# Altium schematic sheet Relay-Switch.SchDoc (part 2 of 2)
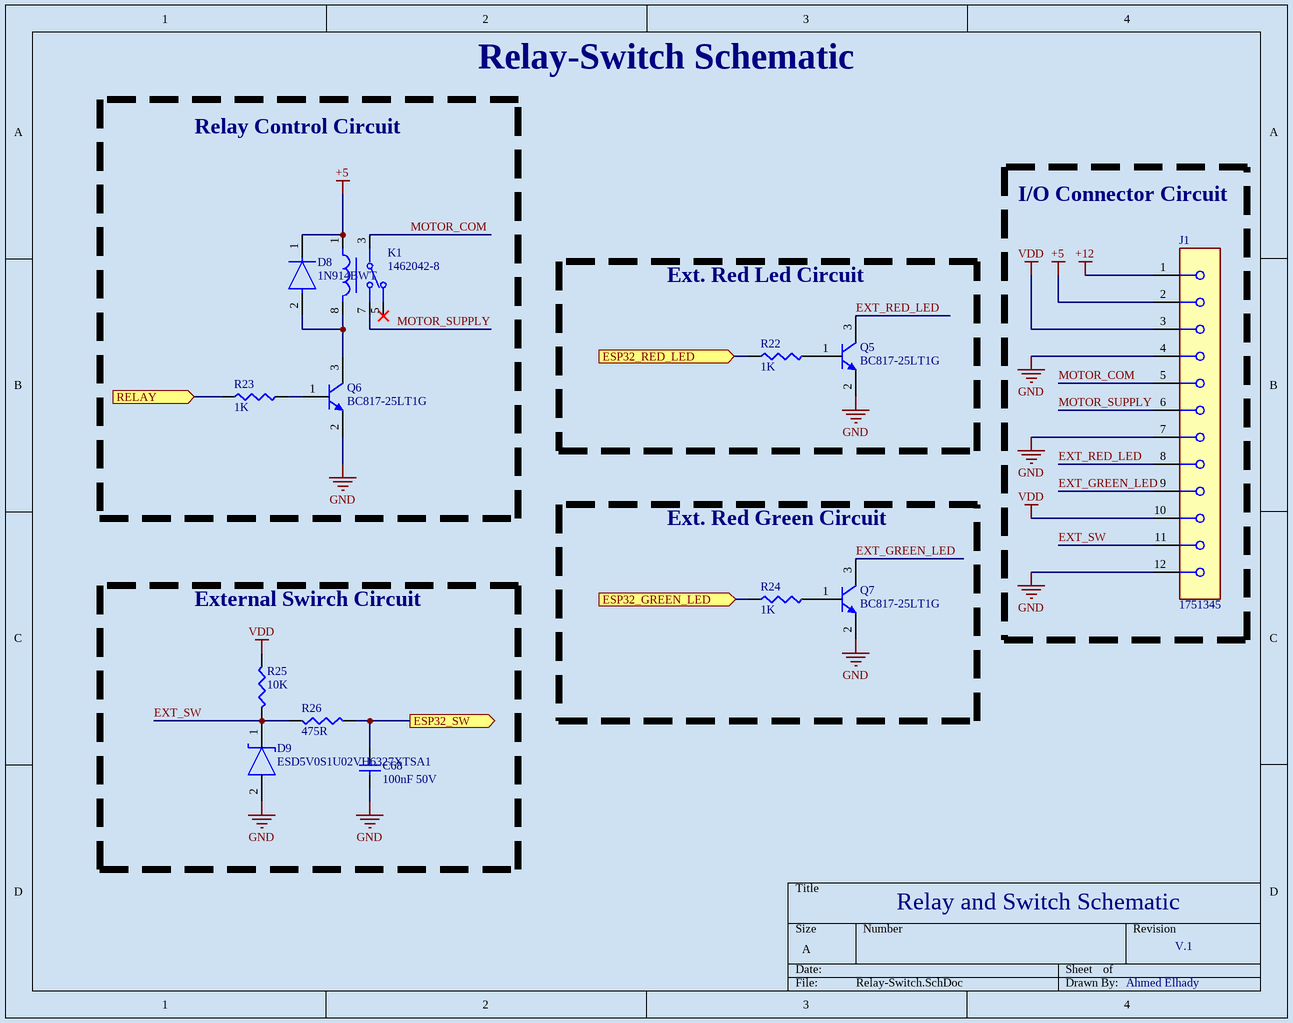
[diagram p1: Relay-Switch.SchDoc]

## Library data of the parts
C68 = CGA3E2X7R1H104K080AA: 0.1 µF ±10% 50V Ceramic Capacitor X7R 0603 (1608 Metric); Manufacturer: TDK; Manufacturer Lifecycle Status: PRODUCTION; Supplier: DigiKey; Manufacturer Part Number: CGA3E2X7R1H104K080AA; RoHS: Compliant; Category: Ceramic Capacitors; Stock: 973492; Pricing: 1=0.1, 10=0.044, 50=0.0302, 100=0.026, 500=0.01886, 1000=0.01666 (USD); Value: 100nF; Case/Package: 0603; Case Code (Imperial): 0603; Case Code (Metric): 1608; China RoHS: Compliant; Composition: Ceramic; Depth: 800µm; Dielectric: X7R; Dielectric Material: Ceramic; Height: 800µm; Lead Free: Lead Free; Length: 1.6mm; Lifecycle Status: Production; Material: Ceramic; Max Length: 1.7mm; Max Operating Temperature: 125°C; Max Width: 900µm; Min Length: 1.5mm; Min Operating Temperature: -55°C; Min Width: 700µm; Mounting Technology: Surface Mount; Number of Terminals: 2; Radiation Hardening: No; Ratings: AEC-Q200; REACH SVHC: Yes; Schedule B: 8532240020, 8532240020|8532240020|8532240020|8532240020|8532240020; Termination: SMD/SMT; Thickness: 889µm; Tolerance: 10%; Voltage: 50V; Voltage Rating: 50V; Voltage Rating (DC): 50V; Weight: 2.012816mg; Width: 800µm; ComponentLink1URL: https://datasheet.octopart.com:443/CGA3E2X7R1H104K080AA-TDK-datasheet-165583812.pdf?src-supplier=IHS; ComponentLink1Description: https://datasheet.octopart.com:443/CGA3E2X7R1H104K080AA-TDK-datasheet-165583812.pdf?src-supplier=IHS; ComponentLink2URL: https://datasheet.octopart.com:443/CGA3E2X7R1H104K080AA-TDK-datasheet-138890726.pdf?src-supplier=Upverter; ComponentLink2Description: https://datasheet.octopart.com:443/CGA3E2X7R1H104K080AA-TDK-datasheet-138890726.pdf?src-supplier=Upverter; ComponentLink3URL: https://datasheet.octopart.com:443/CGA3E2X7R1H104K080AA-TDK-datasheet-43457115.pdf?src-supplier=Upverter; ComponentLink3Description: https://datasheet.octopart.com:443/CGA3E2X7R1H104K080AA-TDK-datasheet-43457115.pdf?src-supplier=Upverter; ComponentLink4URL: https://datasheet.octopart.com:443/CGA3E2X7R1H104K080AA-TDK-datasheet-151546526.pdf?src-supplier=ODG+(Origin+Data+Global); ComponentLink4Description: https://datasheet.octopart.com:443/CGA3E2X7R1H104K080AA-TDK-datasheet-151546526.pdf?src-supplier=ODG+(Origin+Data+Global); ComponentLink5URL: https://datasheet.octopart.com:443/CGA3E2X7R1H104K080AA-TDK-datasheet-43366117.pdf?src-supplier=Newark; ComponentLink5Description: https://datasheet.octopart.com:443/CGA3E2X7R1H104K080AA-TDK-datasheet-43366117.pdf?src-supplier=Newark; ComponentLink6URL: https://datasheet.octopart.com:443/CGA3E2X7R1H104K080AA-TDK-datasheet-23766614.pdf?src-supplier=Newark; ComponentLink6Description: https://datasheet.octopart.com:443/CGA3E2X7R1H104K080AA-TDK-datasheet-23766614.pdf?src-supplier=Newark; ComponentLink7URL: https://datasheet.octopart.com:443/CGA3E2X7R1H104K080AA-TDK-datasheet-13444418.pdf?src-supplier=Newark; ComponentLink7Description: https://datasheet.octopart.com:443/CGA3E2X7R1H104K080AA-TDK-datasheet-13444418.pdf?src-supplier=Newark; ComponentLink8URL: https://datasheet.octopart.com:443/CGA3E2X7R1H104K080AA.-TDK-datasheet-159510193.pdf?src-supplier=Newark; ComponentLink8Description: https://datasheet.octopart.com:443/CGA3E2X7R1H104K080AA.-TDK-datasheet-159510193.pdf?src-supplier=Newark; ComponentLink9URL: https://datasheet.octopart.com:443/CGA3E2X7R1H104K080AA-TDK-datasheet-136412745.pdf?src-supplier=element14+APAC; ComponentLink9Description: https://datasheet.octopart.com:443/CGA3E2X7R1H104K080AA-TDK-datasheet-136412745.pdf?src-supplier=element14+APAC; ComponentLink10URL: https://datasheet.octopart.com:443/CGA3E2X7R1H104K080AA-TDK-datasheet-21217900.pdf?src-supplier=Farnell; ComponentLink10Description: https://datasheet.octopart.com:443/CGA3E2X7R1H104K080AA-TDK-datasheet-21217900.pdf?src-supplier=Farnell; ComponentLink11URL: https://datasheet.octopart.com:443/CGA3E2X7R1H104K080AA-TDK-datasheet-164882302.pdf?src-supplier=Burklin+Elektronik; ComponentLink11Description: https://datasheet.octopart.com:443/CGA3E2X7R1H104K080AA-TDK-datasheet-164882302.pdf?src-supplier=Burklin+Elektronik; ComponentLink12URL: https://datasheet.octopart.com:443/CGA3E2X7R1H104K080AA-TDK-datasheet-13234200.pdf?src-supplier=Future+Electronics; ComponentLink12Description: https://datasheet.octopart.com:443/CGA3E2X7R1H104K080AA-TDK-datasheet-13234200.pdf?src-supplier=Future+Electronics; ComponentLink13URL: https://datasheet.octopart.com:443/CGA3E2X7R1H104K080AA-TDK-datasheet-12527010.pdf?src-supplier=Future+Electronics; ComponentLink13Description: https://datasheet.octopart.com:443/CGA3E2X7R1H104K080AA-TDK-datasheet-12527010.pdf?src-supplier=Future+Electronics; ComponentLink14URL: https://datasheet.octopart.com:443/CGA3E2X7R1H104K080AA-TDK-datasheet-140571036.pdf?src-supplier=Arrow.cn; ComponentLink14Description: https://datasheet.octopart.com:443/CGA3E2X7R1H104K080AA-TDK-datasheet-140571036.pdf?src-supplier=Arrow.cn; LCSC PN: C189228
D8 = 1N914BWT: Diode 75 V 200mA Surface Mount SOD-523F; Manufacturer: onsemi; Manufacturer Lifecycle Status: ACTIVE; Value: 4pF; Element Configuration: Single; Forward Current: 300mA; Forward Voltage: 720mV; Max Junction Temperature (Tj): 150°C; Max Output current: 150mA; Max Power Dissipation: 200mW; Max Repetitive Reverse Voltage (Vrrm): 75V; Max Reverse Leakage Current: 5µA; Number of Elements: 1; Recovery Time: 4ns; Reverse Voltage: 100V; Supplier: DigiKey; Manufacturer Part Number: 1N914BWT; RoHS: Compliant; Category: Rectifier Diodes; Stock: 477421; Pricing: 1=0.1, 10=0.049, 100=0.0485, 500=0.038, 1000=0.03306, 2000=0.03258 (USD); Average Rectified Current: 200mA; China RoHS: Compliant; Contact Plating: Tin; Height: 700µm; Lead Free: Lead Free; Lifecycle Status: Production; Max Operating Temperature: 150°C; Max Reverse Voltage (DC): 75V; Min Operating Temperature: -55°C; Mounting Technology: Surface Mount; Pins: 2; Number of Terminals: 2; Peak Reverse Current: 5µA; Power Dissipation: 200mW; Radiation Hardening: No; REACH SVHC: Yes; Reverse Recovery Time: 4ns; Reverse Standoff Voltage: 75V; Schedule B: 8541100070, 8541100070|8541100070|8541100070|8541100070|8541100070; Weight: 10mg; ComponentLink1URL: https://datasheet.octopart.com:443/1N914BWT-ON-Semiconductor-datasheet-137236191.pdf?src-supplier=Master+Electronics; ComponentLink1Description: https://datasheet.octopart.com:443/1N914BWT-ON-Semiconductor-datasheet-137236191.pdf?src-supplier=Master+Electronics; ComponentLink2URL: https://sigma.octopart.com:443/138897313/technical_drawing/ON-Semiconductor-1N914BWT.pdf?src-supplier=Upverter; ComponentLink2Description: https://sigma.octopart.com:443/138897313/technical_drawing/ON-Semiconductor-1N914BWT.pdf?src-supplier=Upverter; ComponentLink3URL: https://datasheet.octopart.com:443/1N914BWT-ON-Semiconductor-datasheet-8641207.pdf?src-supplier=IHS; ComponentLink3Description: https://datasheet.octopart.com:443/1N914BWT-ON-Semiconductor-datasheet-8641207.pdf?src-supplier=IHS; ComponentLink4URL: https://datasheet.octopart.com:443/1N914BWT-onsemi-datasheet-181265884.pdf?src-supplier=IHS; ComponentLink4Description: https://datasheet.octopart.com:443/1N914BWT-onsemi-datasheet-181265884.pdf?src-supplier=IHS; ComponentLink5URL: https://datasheet.octopart.com:443/1N914BWT-ON-Semiconductor-datasheet-85393215.pdf?src-supplier=onsemi; ComponentLink5Description: https://datasheet.octopart.com:443/1N914BWT-ON-Semiconductor-datasheet-85393215.pdf?src-supplier=onsemi; ComponentLink6URL: https://datasheet.octopart.com:443/1N914BWT-ON-Semiconductor-datasheet-86684494.pdf?src-supplier=onsemi; ComponentLink6Description: https://datasheet.octopart.com:443/1N914BWT-ON-Semiconductor-datasheet-86684494.pdf?src-supplier=onsemi; ComponentLink7URL: https://datasheet.octopart.com:443/1N914BWT-ON-Semiconductor-datasheet-86681974.pdf?src-supplier=element14+APAC; ComponentLink7Description: https://datasheet.octopart.com:443/1N914BWT-ON-Semiconductor-datasheet-86681974.pdf?src-supplier=element14+APAC; ComponentLink8URL: https://datasheet.octopart.com:443/1N914BWT-Fairchild-datasheet-597795.pdf?src-supplier=Future+Electronics; ComponentLink8Description: https://datasheet.octopart.com:443/1N914BWT-Fairchild-datasheet-597795.pdf?src-supplier=Future+Electronics; ComponentLink9URL: https://sigma.octopart.com:443/17343427/technical_drawing/Fairchild-Semiconductor-1N914BWT.pdf?src-supplier=Fairchild+Semiconductor; ComponentLink9Description: https://sigma.octopart.com:443/17343427/technical_drawing/Fairchild-Semiconductor-1N914BWT.pdf?src-supplier=Fairchild+Semiconductor; ComponentLink10URL: https://datasheet.octopart.com:443/1N914BWT-Fairchild-Semiconductor-datasheet-67878665.pdf?src-supplier=Farnell; ComponentLink10Description: https://datasheet.octopart.com:443/1N914BWT-Fairchild-Semiconductor-datasheet-67878665.pdf?src-supplier=Farnell; ComponentLink11URL: https://datasheet.octopart.com:443/1N914BWT-Fairchild-Semiconductor-datasheet-68649996.pdf?src-supplier=Farnell; ComponentLink11Description: https://datasheet.octopart.com:443/1N914BWT-Fairchild-Semiconductor-datasheet-68649996.pdf?src-supplier=Farnell; ComponentLink12URL: https://datasheet.octopart.com:443/1N914BWT-Fairchild-Semiconductor-datasheet-78857206.pdf?src-supplier=Farnell; ComponentLink12Description: https://datasheet.octopart.com:443/1N914BWT-Fairchild-Semiconductor-datasheet-78857206.pdf?src-supplier=Farnell; ComponentLink13URL: https://datasheet.octopart.com:443/1N914BWT-Fairchild-Semiconductor-datasheet-67909706.pdf?src-supplier=Newark; ComponentLink13Description: https://datasheet.octopart.com:443/1N914BWT-Fairchild-Semiconductor-datasheet-67909706.pdf?src-supplier=Newark; ComponentLink14URL: https://datasheet.octopart.com:443/1N914BWT-Fairchild-Semiconductor-datasheet-68364971.pdf?src-supplier=Newark; ComponentLink14Description: https://datasheet.octopart.com:443/1N914BWT-Fairchild-Semiconductor-datasheet-68364971.pdf?src-supplier=Newark; ComponentLink15URL: https://datasheet.octopart.com:443/1N914BWT-Fairchild-Semiconductor-datasheet-71421042.pdf?src-supplier=Newark; ComponentLink15Description: https://datasheet.octopart.com:443/1N914BWT-Fairchild-Semiconductor-datasheet-71421042.pdf?src-supplier=Newark; ComponentLink16URL: http://sigma.octopart.com:80/150599636/rohs_statement/ON-Semiconductor-1N914BWT.pdf?src-supplier=Compliance+Statements; ComponentLink16Description: http://sigma.octopart.com:80/150599636/rohs_statement/ON-Semiconductor-1N914BWT.pdf?src-supplier=Compliance+Statements; ComponentLink17URL: http://sigma.octopart.com:80/17343722/reach_statement/Fairchild-Semiconductor-1N914BWT.pdf?src-supplier=Compliance+Statements; ComponentLink17Description: http://sigma.octopart.com:80/17343722/reach_statement/Fairchild-Semiconductor-1N914BWT.pdf?src-supplier=Compliance+Statements; ComponentLink18URL: http://sigma.octopart.com:80/17343723/materials_sheet/Fairchild-Semiconductor-1N914BWT.pdf?src-supplier=Compliance+Statements; ComponentLink18Description: http://sigma.octopart.com:80/17343723/materials_sheet/Fairchild-Semiconductor-1N914BWT.pdf?src-supplier=Compliance+Statements; ComponentLink19URL: http://sigma.octopart.com:80/33033631/reach_statement/Fairchild-Semiconductor-1N914BWT.pdf?src-supplier=Compliance+Statements; ComponentLink19Description: http://sigma.octopart.com:80/33033631/reach_statement/Fairchild-Semiconductor-1N914BWT.pdf?src-supplier=Compliance+Statements; ComponentLink20URL: http://sigma.octopart.com:80/33033633/materials_sheet/Fairchild-Semiconductor-1N914BWT.pdf?src-supplier=Compliance+Statements; ComponentLink20Description: http://sigma.octopart.com:80/33033633/materials_sheet/Fairchild-Semiconductor-1N914BWT.pdf?src-supplier=Compliance+Statements; ComponentLink21URL: http://sigma.octopart.com:80/reach_statement/ON-Semiconductor-company-79.pdf?src-supplier=Compliance+Statements; ComponentLink21Description: http://sigma.octopart.com:80/reach_statement/ON-Semiconductor-company-79.pdf?src-supplier=Compliance+Statements; ComponentLink22URL: http://sigma.octopart.com:80/reach_statement/Fairchild-Semiconductor-company-9.pdf?src-supplier=Compliance+Statements; ComponentLink22Description: http://sigma.octopart.com:80/reach_statement/Fairchild-Semiconductor-company-9.pdf?src-supplier=Compliance+Statements; ComponentLink23URL: http://sigma.octopart.com:80/rohs_statement/Fairchild-Semiconductor-company-10.pdf?src-supplier=Compliance+Statements; ComponentLink23Description: http://sigma.octopart.com:80/rohs_statement/Fairchild-Semiconductor-company-10.pdf?src-supplier=Compliance+Statements; ComponentLink24URL: http://sigma.octopart.com:80/rohs_statement/Fairchild-Semiconductor-company-11.pdf?src-supplier=Compliance+Statements; ComponentLink24Description: http://sigma.octopart.com:80/rohs_statement/Fairchild-Semiconductor-company-11.pdf?src-supplier=Compliance+Statements; ComponentLink25URL: https://octopart.com:443/opatz8j6/c1?t=2WqiEKOw8wqArRZqPpvR85ynHt7ZzVk2cO10dLGm-R0uzi761TwnKGd8G704mGlWt5NrywDr0KiccpzbdVN0vLD60p8HUNozkBvJah_YtAF0qkz_YdCTpuTRvpRRGRHvTs5MnoSWnaWLNMk8GsWHB5GOWZxEGL76QI-UHf2VYZrxGgdInPPAHzx67g23p6ag1zMjOvdQ_KO0sLW1YCbP87miLJ-xuglZHSzMiJPSla-JOyFE5O4L_wVOcXuUuW9Nq80bDDjFIEvXv_yLg6OaI31d8ivh4qXBzQAE5bOv_0EkyUSKc6N_Bvj2gIrePwDtp1ZIMUr8bvv7xrz_Ey9Bd0_sQCggic841Ck&src-supplier=Compliance+Statements; ComponentLink25Description: https://octopart.com:443/opatz8j6/c1?t=2WqiEKOw8wqArRZqPpvR85ynHt7ZzVk2cO10dLGm-R0uzi761TwnKGd8G704mGlWt5NrywDr0KiccpzbdVN0vLD60p8HUNozkBvJah_YtAF0qkz_YdCTpuTRvpRRGRHvTs5MnoSWnaWLNMk8GsWHB5GOWZxEGL76QI-UHf2VYZrxGgdInPPAHzx67g23p6ag1zMjOvdQ_KO0sLW1YCbP87miLJ-xuglZHSzMiJPSla-JOyFE5O4L_wVOcXuUuW9Nq80bDDjFIEvXv_yLg6OaI31d8ivh4qXBzQAE5bOv_0EkyUSKc6N_Bvj2gIrePwDtp1ZIMUr8bvv7xrz_Ey9Bd0_sQCggic841Ck&src-supplier=Compliance+Statements; ComponentLink26URL: https://octopart.com:443/opatz8j6/c1?t=RaqNgoITNyWOJnQ6Vh5XIuzQpAbr0CmMJXnszeBW8MsXPXzYAlD6RDR-K-xNy0bOoPbUZIWRPJiazHjtXn9auSuHtYVzaYiY_-4ACrRiEunSg5ftXbk51fnzLHl-pnx-xENRGEoc0sVQC3sW6At9uQOqTuvKnbOKqBSmNHH-_AM452Vbz-1SYlG8b9doSGgNLF68ZLSsI2Xi9YbSWNoCRNsA0utVy25_kYVX52Ab7j5ee_hVQPYkWwgdnH6jdHziL8hQDhpeIfaPz7mxVfqPvCOhRP-Nv0lQS1TZTbPLcILF8nRMY4HoGGGhnPru0GeEwc_xKGUtBaA48gLnW1nYBzFXwEvRb-b_FPUG&src-supplier=Compliance+Statements; ComponentLink26Description: https://octopart.com:443/opatz8j6/c1?t=RaqNgoITNyWOJnQ6Vh5XIuzQpAbr0CmMJXnszeBW8MsXPXzYAlD6RDR-K-xNy0bOoPbUZIWRPJiazHjtXn9auSuHtYVzaYiY_-4ACrRiEunSg5ftXbk51fnzLHl-pnx-xENRGEoc0sVQC3sW6At9uQOqTuvKnbOKqBSmNHH-_AM452Vbz-1SYlG8b9doSGgNLF68ZLSsI2Xi9YbSWNoCRNsA0utVy25_kYVX52Ab7j5ee_hVQPYkWwgdnH6jdHziL8hQDhpeIfaPz7mxVfqPvCOhRP-Nv0lQS1TZTbPLcILF8nRMY4HoGGGhnPru0GeEwc_xKGUtBaA48gLnW1nYBzFXwEvRb-b_FPUG&src-supplier=Compliance+Statements; LCSC PN: C896167
D9 = ESD5V0S1U02VH6327XTSA1: 14.5V (Typ) Clamp 5.5A (8/20µs) Ipp Tvs Diode Surface Mount PG-SC79-2-1; Manufacturer: Infineon; Breakdown Voltage: 6.6V; Value: 35pF; Direction: Unidirectional; Element Configuration: Single; Max Breakdown Voltage: 7.5V; Min Breakdown Voltage: 5.7V; Number of Channels: 1; Peak Pulse Power: 66W; Peak Reverse Current: 100nA; Power Line Protection: No; Reverse Standoff Voltage: 3.3V; Working Voltage: 5V; Supplier: DigiKey; Manufacturer Part Number: ESD5V0S1U02VH6327XTSA1; RoHS: Compliant; Category: TVS Diodes; Stock: 42298; Pricing: 1=0.2, 10=0.129, 100=0.091, 3000=0.068, 6000=0.067, 9000=0.066 (USD); Case/Package: SC; China RoHS: Compliant; Clamping Voltage: 14.5V; Composition: Zener; Depth: 800µm; Halogen Free: Halogen Free; Height: 590µm; Lead Free: Lead Free; Length: 1.2mm; Lifecycle Status: EOL; Max Operating Temperature: 125°C; Min Operating Temperature: -55°C; Mounting Technology: Surface Mount; Number of Elements: 1; Pins: 2; Number of Terminals: 2; Number of Unidirectional Channels: 1; Packaging: Tape & Reel (TR); Peak Pulse Current: 5.5A; Polarity: Unidirectional; Radiation Hardening: No; REACH SVHC: Yes; Schedule B: 8536300000, 8536300000|8536300000|8536300000|8536300000|8536300000; ComponentLink1URL: https://datasheet.octopart.com:443/ESD5V0S1U02VH6327XTSA1-Infineon-datasheet-21383649.pdf?src-supplier=element14+APAC; ComponentLink1Description: https://datasheet.octopart.com:443/ESD5V0S1U02VH6327XTSA1-Infineon-datasheet-21383649.pdf?src-supplier=element14+APAC; ComponentLink2URL: http://sigma.octopart.com:80/conflict_mineral_statement/Infineon-company-51.pdf?src-supplier=Compliance+Statements; ComponentLink2Description: http://sigma.octopart.com:80/conflict_mineral_statement/Infineon-company-51.pdf?src-supplier=Compliance+Statements; LCSC PN: C1974016
J1 = 1751345: 12 Position Wire to Board Terminal Block Horizontal with Board 0.138" (3.50mm) Through Hole; Manufacturer: Phoenix Contact; Approvals: CB, UL, cUL; Connector Type: Screw; Current: 13.5A; Current Rating: 10A; Gender: Male; Max Current Rating: 12A; Max Supply Voltage: 160V; Number of Circuits: 12; Number of Levels: 1; Pitch: 3.5mm; Stripping Length: 5mm; Voltage: 300V; Wire/Cable Gauge: 16AWG; Wire Gauge (Max): 26AWG; Supplier: DigiKey; Manufacturer Part Number: 1751345; RoHS: Compliant; Category: Terminal Blocks; Stock: 579; Pricing: 1=7.67, 10=6.066 (USD); China RoHS: Compliant; Color: Green; Contact Material: Tin; Depth: 7.3mm; Flammability Rating: UL94 V-0; Height: 12mm; Housing Color: Green; Housing Material: Polyamide; Insulation Material: Nylon; Lead Free: Lead Free; Length: 42.5mm; Lifecycle Status: Production; Material: Polyamide; Mounting Technology: Screw; Number of Contacts: 12; Pins: 12; Number of Poles: 12; Number of Positions: 12; Number of Positions Per Level: 12; Number of Rows: 1; Orientation: Straight; Radiation Hardening: No; REACH SVHC: Yes; Termination: Screw; Voltage Rating: 160V; Weight: 6.200012g; Width: 7.3mm; Wire Gauge (Min): 16AWG; ComponentLink1URL: https://datasheet.octopart.com:443/1751345-Phoenix-Contact-datasheet-181077025.pdf?src-supplier=IHS; ComponentLink1Description: https://datasheet.octopart.com:443/1751345-Phoenix-Contact-datasheet-181077025.pdf?src-supplier=IHS; ComponentLink2URL: https://datasheet.octopart.com:443/1751345-Phoenix-Contact-datasheet-86450921.pdf?src-supplier=Farnell; ComponentLink2Description: https://datasheet.octopart.com:443/1751345-Phoenix-Contact-datasheet-86450921.pdf?src-supplier=Farnell; ComponentLink3URL: https://datasheet.octopart.com:443/MKDS-1-12-3%2C5-Phoenix-Contact-datasheet-42256239.pdf?src-supplier=element14+APAC; ComponentLink3Description: https://datasheet.octopart.com:443/MKDS-1-12-3%2C5-Phoenix-Contact-datasheet-42256239.pdf?src-supplier=element14+APAC; ComponentLink4URL: https://datasheet.octopart.com:443/1751345-Phoenix-Contact-datasheet-154779214.pdf?src-supplier=Electro+Sonic; ComponentLink4Description: https://datasheet.octopart.com:443/1751345-Phoenix-Contact-datasheet-154779214.pdf?src-supplier=Electro+Sonic; ComponentLink5URL: https://datasheet.octopart.com:443/1751345-Phoenix-Contact-datasheet-177325489.pdf?src-supplier=Burklin+Elektronik; ComponentLink5Description: https://datasheet.octopart.com:443/1751345-Phoenix-Contact-datasheet-177325489.pdf?src-supplier=Burklin+Elektronik; ComponentLink6URL: https://datasheet.octopart.com:443/1751345-Phoenix-Contact-datasheet-62122524.pdf?src-supplier=RS+(Formerly+Allied+Electronics); ComponentLink6Description: https://datasheet.octopart.com:443/1751345-Phoenix-Contact-datasheet-62122524.pdf?src-supplier=RS+(Formerly+Allied+Electronics); ComponentLink7URL: https://datasheet.octopart.com:443/1751345-Phoenix-Contact-datasheet-9939319.pdf?src-supplier=RS+(Formerly+Allied+Electronics); ComponentLink7Description: https://datasheet.octopart.com:443/1751345-Phoenix-Contact-datasheet-9939319.pdf?src-supplier=RS+(Formerly+Allied+Electronics); ComponentLink8URL: https://datasheet.octopart.com:443/1751345-Phoenix-Contact-datasheet-68130.pdf?src-supplier=RS+(Formerly+Allied+Electronics); ComponentLink8Description: https://datasheet.octopart.com:443/1751345-Phoenix-Contact-datasheet-68130.pdf?src-supplier=RS+(Formerly+Allied+Electronics); ComponentLink9URL: https://datasheet.octopart.com:443/1751345-Phoenix-Contact-datasheet-33465275.pdf?src-supplier=MRO+Stop; ComponentLink9Description: https://datasheet.octopart.com:443/1751345-Phoenix-Contact-datasheet-33465275.pdf?src-supplier=MRO+Stop; ComponentLink10URL: https://datasheet.octopart.com:443/1751345-Phoenix-Contact-datasheet-11783629.pdf?src-supplier=Arrow+Electronics; ComponentLink10Description: https://datasheet.octopart.com:443/1751345-Phoenix-Contact-datasheet-11783629.pdf?src-supplier=Arrow+Electronics; LCSC PN: C6651535
K1 = 1462042-8: Telecom Relay SPDT (1 Form C) Surface Mount; Manufacturer: TE Connectivity; Manufacturer Lifecycle Status: ACTIVE; Coil Current: 28mA; Coil Power: 140mW; Coil Resistance: 178Ω; Coil Type: Non-Latching; Coil Voltage (DC): 3.75V; Contact Current Rating: 3A; Contact Resistance: 50mΩ; Contact Voltage Rating (AC): 250V; Contact Voltage Rating (DC): 220V; Current Rating: 4A; Electrical Life: 100kcycles; Insertion Loss (dB): -0.03dB; Insulation Resistance: 1TΩ; Clock Frequency: 900MHz; Number of Contacts: 1; Operate Time: 1ms; Release Time: 2ms; Sealable: IP67, RT5; Supplier: DigiKey; Manufacturer Part Number: 1462042-8; RoHS: Compliant; Category: Signal Relays; Pricing: 1=4.05, 10=3.609, 25=3.4468, 50=3.3286, 100=3.2145, 250=3.06948, 500=2.96408 (USD); Ambient Temperature Range High: 85°C; China RoHS: Compliant; Contact Material: Gold, Ruthenium; Contact Plating: Gold; Depth: 7.5mm; ELV: Compliant; Height: 5.65mm; Lead Free: Lead Free; Length: 9.9822mm; Lifecycle Status: Production; Max Current Rating: 3A; Max Operating Temperature: 85°C; Max Voltage Rating (AC): 250V; Max Voltage Rating (DC): 220V; Min Operating Temperature: -40°C; Mounting Technology: Surface Mount; Pins: 5; Number of Terminals: 5; Packaging: Tape and Reel; REACH SVHC: Yes; Relay Type: Relay; Response Time: 2ms; Switching Current: 4A; Termination: PCB; Throw Configuration: SPDT; Voltage Rating (AC): 250V; Voltage Rating (DC): 220V; Weight: 750mg; Width: 5.6388mm; ComponentLink1URL: https://datasheet.octopart.com:443/1462042-8-TE-Connectivity-datasheet-137420492.pdf?src-supplier=JRH+Electronics; ComponentLink1Description: https://datasheet.octopart.com:443/1462042-8-TE-Connectivity-datasheet-137420492.pdf?src-supplier=JRH+Electronics; ComponentLink2URL: https://datasheet.octopart.com:443/1462042-8-TE-Connectivity-datasheet-179946163.pdf?src-supplier=IHS; ComponentLink2Description: https://datasheet.octopart.com:443/1462042-8-TE-Connectivity-datasheet-179946163.pdf?src-supplier=IHS; ComponentLink3URL: https://sigma.octopart.com:443/38875905/technical_drawing/TE-Connectivity-1462042-8.pdf?src-supplier=TE+Connectivity; ComponentLink3Description: https://sigma.octopart.com:443/38875905/technical_drawing/TE-Connectivity-1462042-8.pdf?src-supplier=TE+Connectivity; ComponentLink4URL: https://datasheet.octopart.com:443/1462042-8-TE-Connectivity-datasheet-14547674.pdf?src-supplier=TE+Connectivity; ComponentLink4Description: https://datasheet.octopart.com:443/1462042-8-TE-Connectivity-datasheet-14547674.pdf?src-supplier=TE+Connectivity; ComponentLink5URL: https://datasheet.octopart.com:443/1462042-8-TE-Connectivity-datasheet-136865190.pdf?src-supplier=TE+Connectivity; ComponentLink5Description: https://datasheet.octopart.com:443/1462042-8-TE-Connectivity-datasheet-136865190.pdf?src-supplier=TE+Connectivity; ComponentLink6URL: https://datasheet.octopart.com:443/1462042-8-TE-Connectivity-datasheet-136861145.pdf?src-supplier=TE+Connectivity; ComponentLink6Description: https://datasheet.octopart.com:443/1462042-8-TE-Connectivity-datasheet-136861145.pdf?src-supplier=TE+Connectivity; ComponentLink7URL: https://sigma.octopart.com:443/136536779/technical_drawing/TE-Connectivity-1462042-8.pdf?src-supplier=TE+Connectivity; ComponentLink7Description: https://sigma.octopart.com:443/136536779/technical_drawing/TE-Connectivity-1462042-8.pdf?src-supplier=TE+Connectivity; ComponentLink8URL: https://sigma.octopart.com:443/68321908/technical_drawing/TE-Connectivity-1462042-8.pdf?src-supplier=TE+Connectivity; ComponentLink8Description: https://sigma.octopart.com:443/68321908/technical_drawing/TE-Connectivity-1462042-8.pdf?src-supplier=TE+Connectivity; ComponentLink9URL: https://sigma.octopart.com:443/14546022/technical_drawing/TE-Connectivity-1462042-8.pdf?src-supplier=TE+Connectivity; ComponentLink9Description: https://sigma.octopart.com:443/14546022/technical_drawing/TE-Connectivity-1462042-8.pdf?src-supplier=TE+Connectivity; ComponentLink10URL: https://datasheet.octopart.com:443/1462042-8-TE-Connectivity-datasheet-130056123.pdf?src-supplier=Electro+Sonic; ComponentLink10Description: https://datasheet.octopart.com:443/1462042-8-TE-Connectivity-datasheet-130056123.pdf?src-supplier=Electro+Sonic; ComponentLink11URL: https://datasheet.octopart.com:443/1462042-8-TE-Connectivity-datasheet-129083727.pdf?src-supplier=Electro+Sonic; ComponentLink11Description: https://datasheet.octopart.com:443/1462042-8-TE-Connectivity-datasheet-129083727.pdf?src-supplier=Electro+Sonic; ComponentLink12URL: https://datasheet.octopart.com:443/1462042-8-Tyco-Electronics-datasheet-11758492.pdf?src-supplier=Electro+Sonic; ComponentLink12Description: https://datasheet.octopart.com:443/1462042-8-Tyco-Electronics-datasheet-11758492.pdf?src-supplier=Electro+Sonic; ComponentLink13URL: https://datasheet.octopart.com:443/1462042-8-TE-Connectivity-datasheet-114345573.pdf?src-supplier=Master+Electronics; ComponentLink13Description: https://datasheet.octopart.com:443/1462042-8-TE-Connectivity-datasheet-114345573.pdf?src-supplier=Master+Electronics; ComponentLink14URL: https://datasheet.octopart.com:443/1462042-8-TE-Connectivity-datasheet-82456702.pdf?src-supplier=Farnell; ComponentLink14Description: https://datasheet.octopart.com:443/1462042-8-TE-Connectivity-datasheet-82456702.pdf?src-supplier=Farnell; ComponentLink15URL: https://datasheet.octopart.com:443/1462042-8-TE-Connectivity-datasheet-147567808.pdf?src-supplier=RS+(Formerly+Allied+Electronics); ComponentLink15Description: https://datasheet.octopart.com:443/1462042-8-TE-Connectivity-datasheet-147567808.pdf?src-supplier=RS+(Formerly+Allied+Electronics); ComponentLink16URL: https://datasheet.octopart.com:443/1462042-8-TE-Connectivity-datasheet-147411287.pdf?src-supplier=RS+(Formerly+Allied+Electronics); ComponentLink16Description: https://datasheet.octopart.com:443/1462042-8-TE-Connectivity-datasheet-147411287.pdf?src-supplier=RS+(Formerly+Allied+Electronics); ComponentLink17URL: https://datasheet.octopart.com:443/1462042-8-TE-Connectivity-datasheet-147402889.pdf?src-supplier=RS+(Formerly+Allied+Electronics); ComponentLink17Description: https://datasheet.octopart.com:443/1462042-8-TE-Connectivity-datasheet-147402889.pdf?src-supplier=RS+(Formerly+Allied+Electronics); ComponentLink18URL: https://datasheet.octopart.com:443/1462042-8-Axicom-datasheet-15983679.pdf?src-supplier=Newark; ComponentLink18Description: https://datasheet.octopart.com:443/1462042-8-Axicom-datasheet-15983679.pdf?src-supplier=Newark; ComponentLink19URL: https://datasheet.octopart.com:443/1462042-8-TE-Connectivity-datasheet-15792550.pdf?src-supplier=Future+Electronics; ComponentLink19Description: https://datasheet.octopart.com:443/1462042-8-TE-Connectivity-datasheet-15792550.pdf?src-supplier=Future+Electronics; ComponentLink20URL: http://sigma.octopart.com:80/99347369/materials_sheet/TE-Connectivity-1462042-8.pdf?src-supplier=Compliance+Statements; ComponentLink20Description: http://sigma.octopart.com:80/99347369/materials_sheet/TE-Connectivity-1462042-8.pdf?src-supplier=Compliance+Statements; ComponentLink21URL: http://sigma.octopart.com:80/14547716/rohs_certificate/AMP-1462042-8.pdf?src-supplier=Compliance+Statements; ComponentLink21Description: http://sigma.octopart.com:80/14547716/rohs_certificate/AMP-1462042-8.pdf?src-supplier=Compliance+Statements; LCSC PN: C574842
Q5-Q7 = BC817-25LT1G: Bipolar (BJT) Transistor NPN 45 V 500 mA 100MHz 300 mW Surface Mount SOT-23-3 (TO-236); Manufacturer: onsemi; Manufacturer Lifecycle Status: ACTIVE; Collector Base Voltage (VCBO): 50V; Collector Emitter Breakdown Voltage: 45V; Collector Emitter Saturation Voltage: 700mV; Current Rating: 500mA; Element Configuration: Single; Emitter Base Voltage (VEBO): 5V; hFE Min: 160; Max Power Dissipation: 300mW; Number of Elements: 1; Supplier: DigiKey; Manufacturer Part Number: BC817-25LT1G; RoHS: Compliant; Category: BJTs; Stock: 142814; Pricing: 1=0.15, 10=0.094, 100=0.0578, 500=0.04192, 1000=0.03675, 3000=0.03013, 6000=0.02679, 9000=0.02508, 15000=0.02315, 21000=0.02201, 30000=0.0209, 75000=0.01847, 150000=0.01696, 300000=0.0157 (USD); Case/Package: SOT-23-3; China RoHS: Compliant; Collector Emitter Voltage (VCEO): 45V; Contact Plating: Tin; Frequency: 100MHz; Gain Bandwidth Product: 100MHz; Halogen Free: Halogen Free; Height: 940µm; Lead Free: Lead Free; Length: 2.9mm; Lifecycle Status: Production; Max Breakdown Voltage: 45V; Max Collector Current: 500mA; Clock Frequency: 100MHz; Max Operating Temperature: 150°C; Min Operating Temperature: -65°C; Pins: 3; Number of Terminals: 3; Packaging: Tape and Reel; Polarity: NPN; Power Dissipation: 300mW; Radiation Hardening: No; REACH SVHC: Yes; Schedule B: 8541210080, 8541210080|8541210080|8541210080|8541210080|8541210080|8541210080|8541210080|8541210080|8541210080|8541210080|8541210080|8541210080|8541210080|8541210080|8541210080|8541210080|8541210080|8541210080|8541210080|8541210080|8541210080|8541210080|8541210080|85; Transition Frequency: 100MHz; Width: 1.3mm; ComponentLink1URL: https://datasheet.octopart.com:443/BC817-25LT1G-onsemi-datasheet-175914671.pdf?src-supplier=IHS; ComponentLink1Description: https://datasheet.octopart.com:443/BC817-25LT1G-onsemi-datasheet-175914671.pdf?src-supplier=IHS; ComponentLink2URL: https://datasheet.octopart.com:443/BC817-25LT1G-ON-Semiconductor-datasheet-11547464.pdf?src-supplier=Farnell; ComponentLink2Description: https://datasheet.octopart.com:443/BC817-25LT1G-ON-Semiconductor-datasheet-11547464.pdf?src-supplier=Farnell; ComponentLink3URL: https://datasheet.octopart.com:443/BC817-25LT1G-onsemi-datasheet-170668855.pdf?src-supplier=Farnell; ComponentLink3Description: https://datasheet.octopart.com:443/BC817-25LT1G-onsemi-datasheet-170668855.pdf?src-supplier=Farnell; ComponentLink4URL: https://datasheet.octopart.com:443/BC817-25LT1G-ON-Semiconductor-datasheet-8110464.pdf?src-supplier=Newark; ComponentLink4Description: https://datasheet.octopart.com:443/BC817-25LT1G-ON-Semiconductor-datasheet-8110464.pdf?src-supplier=Newark; ComponentLink5URL: https://datasheet.octopart.com:443/BC817-25LT1G-ON-Semiconductor-datasheet-6400296.pdf?src-supplier=Newark; ComponentLink5Description: https://datasheet.octopart.com:443/BC817-25LT1G-ON-Semiconductor-datasheet-6400296.pdf?src-supplier=Newark; ComponentLink6URL: https://datasheet.octopart.com:443/BC817-25LT1G-ON-Semiconductor-datasheet-37521415.pdf?src-supplier=Newark; ComponentLink6Description: https://datasheet.octopart.com:443/BC817-25LT1G-ON-Semiconductor-datasheet-37521415.pdf?src-supplier=Newark; ComponentLink7URL: https://datasheet.octopart.com:443/BC817-25LT1G-ON-Semiconductor-datasheet-78758879.pdf?src-supplier=element14+APAC; ComponentLink7Description: https://datasheet.octopart.com:443/BC817-25LT1G-ON-Semiconductor-datasheet-78758879.pdf?src-supplier=element14+APAC; ComponentLink8URL: https://datasheet.octopart.com:443/BC817-25LT1G-ON-Semiconductor-datasheet-133521192.pdf?src-supplier=TME; ComponentLink8Description: https://datasheet.octopart.com:443/BC817-25LT1G-ON-Semiconductor-datasheet-133521192.pdf?src-supplier=TME; ComponentLink9URL: https://datasheet.octopart.com:443/BC817-25LT1G-ON-Semiconductor-datasheet-8514921.pdf?src-supplier=TME; ComponentLink9Description: https://datasheet.octopart.com:443/BC817-25LT1G-ON-Semiconductor-datasheet-8514921.pdf?src-supplier=TME; ComponentLink10URL: https://datasheet.octopart.com:443/BC817-25LT1G-ON-Semiconductor-datasheet-14064575.pdf?src-supplier=iiiC; ComponentLink10Description: https://datasheet.octopart.com:443/BC817-25LT1G-ON-Semiconductor-datasheet-14064575.pdf?src-supplier=iiiC; ComponentLink11URL: https://datasheet.octopart.com:443/BC817-25LT1G-ON-Semiconductor-datasheet-7835642.pdf?src-supplier=Jameco; ComponentLink11Description: https://datasheet.octopart.com:443/BC817-25LT1G-ON-Semiconductor-datasheet-7835642.pdf?src-supplier=Jameco; ComponentLink12URL: http://sigma.octopart.com:80/15540786/rohs_certificate/ON-Semiconductor-BC817-25LT1G.pdf?src-supplier=Compliance+Statements; ComponentLink12Description: http://sigma.octopart.com:80/15540786/rohs_certificate/ON-Semiconductor-BC817-25LT1G.pdf?src-supplier=Compliance+Statements; ComponentLink13URL: http://sigma.octopart.com:80/15674305/materials_sheet/ON-Semiconductor-BC817-25LT1G.csv?src-supplier=Compliance+Statements; ComponentLink13Description: http://sigma.octopart.com:80/15674305/materials_sheet/ON-Semiconductor-BC817-25LT1G.csv?src-supplier=Compliance+Statements; ComponentLink14URL: http://sigma.octopart.com:80/150605443/rohs_statement/ON-Semiconductor-BC817-25LT1G.pdf?src-supplier=Compliance+Statements; ComponentLink14Description: http://sigma.octopart.com:80/150605443/rohs_statement/ON-Semiconductor-BC817-25LT1G.pdf?src-supplier=Compliance+Statements; ComponentLink15URL: http://sigma.octopart.com:80/reach_statement/ON-Semiconductor-company-79.pdf?src-supplier=Compliance+Statements; ComponentLink15Description: http://sigma.octopart.com:80/reach_statement/ON-Semiconductor-company-79.pdf?src-supplier=Compliance+Statements; ComponentLink16URL: https://octopart.com:443/opatz8j6/c1?t=FMsNQxrESUyRCPfq8gEj-DENtH3fHkNbbx7UbSs21QzU062yKLGbhUPUpIPy5Xi2ZgBFMEWC5ngHpKXITW9o0rg8ZidRfVCdiF7DZxIUHj2cNfr8gf2p9sCWHDNE-sxkc6W2BttQviWA7OCItC8CjtgmEljBkJW6GmILXQbN04cp2GQUqNfi_HUatOdtl3tLh4sFZvT2DatCOdRbxwA31VwVMIuNhQnoyD21S4-x6Z79kKhsk9HH9ZODpaAlNr6omSmc7dMXiU0xuY1E2aXtxCwt8dPdGEJSzGfpDZ8ebuqGRHbHeVQrJUO3-XmL1gKZT6KZ_KTGZyS5nRtcW4b1fsWAnEei7rLIFfCT6CDP&src-supplier=Compliance+Statements; ComponentLink16Description: https://octopart.com:443/opatz8j6/c1?t=FMsNQxrESUyRCPfq8gEj-DENtH3fHkNbbx7UbSs21QzU062yKLGbhUPUpIPy5Xi2ZgBFMEWC5ngHpKXITW9o0rg8ZidRfVCdiF7DZxIUHj2cNfr8gf2p9sCWHDNE-sxkc6W2BttQviWA7OCItC8CjtgmEljBkJW6GmILXQbN04cp2GQUqNfi_HUatOdtl3tLh4sFZvT2DatCOdRbxwA31VwVMIuNhQnoyD21S4-x6Z79kKhsk9HH9ZODpaAlNr6omSmc7dMXiU0xuY1E2aXtxCwt8dPdGEJSzGfpDZ8ebuqGRHbHeVQrJUO3-XmL1gKZT6KZ_KTGZyS5nRtcW4b1fsWAnEei7rLIFfCT6CDP&src-supplier=Compliance+Statements; ComponentLink17URL: https://octopart.com:443/opatz8j6/c1?t=nUlRrpbF6WczGPO4pfpwBQnU8fi4iCX0epaFCyCK5fth2mOyA6hTCg2G-3-aRRCFw6eqU5JL2JnXrg6A8MVo7KmYt6NPPgcW19QVy9UVLDMw0wHerXAS-lYwjKrGA4wCzbzo9kSFOmU6PWTwVGPEy2GV6BB97n73KCQuFBzDaEH8TUlznyjJWhX0CV-DoAJbMyOpHAIak4qDziO0AtpTCMCbDoHlJldnv_22h4vP_pcU7ZMh310hdqdTKbwu0WkHWG1jzAabqffap4mChuo48GQ05l2336dYBbKSVi3hosrG61bKpJQhz_hO3_YlwH57PQUCekH-ynXCso-DdhQFN3ouqaKvySp1Gcbov0g&src-supplier=Compliance+Statements; ComponentLink17Description: https://octopart.com:443/opatz8j6/c1?t=nUlRrpbF6WczGPO4pfpwBQnU8fi4iCX0epaFCyCK5fth2mOyA6hTCg2G-3-aRRCFw6eqU5JL2JnXrg6A8MVo7KmYt6NPPgcW19QVy9UVLDMw0wHerXAS-lYwjKrGA4wCzbzo9kSFOmU6PWTwVGPEy2GV6BB97n73KCQuFBzDaEH8TUlznyjJWhX0CV-DoAJbMyOpHAIak4qDziO0AtpTCMCbDoHlJldnv_22h4vP_pcU7ZMh310hdqdTKbwu0WkHWG1jzAabqffap4mChuo48GQ05l2336dYBbKSVi3hosrG61bKpJQhz_hO3_YlwH57PQUCekH-ynXCso-DdhQFN3ouqaKvySp1Gcbov0g&src-supplier=Compliance+Statements; LCSC PN: C82635
R22-R24 = RK73B1JTTD102J: 1 kOhms ±5% 0.125W, 1/8W Chip Resistor 0603 (1608 Metric) Automotive AEC-Q200 Thick Film
R25 = RC0603FR-0710KL: 10 kOhms ±1% 0.1W, 1/10W Chip Resistor 0603 (1608 Metric) Moisture Resistant Thick Film; Manufacturer: Yageo Group; Power Dissipation: 100mW; Value: 10kΩ; Temperature Coefficient: 100ppm/°C; Voltage Rating: 75V; Voltage Rating (DC): 50V; Supplier: DigiKey; Manufacturer Part Number: RC0603FR-0710KL; RoHS: Compliant; Category: Chip SMD Resistors; Stock: 14914136; Pricing: 1=0.1, 10=0.006, 25=0.0052 (USD); Case/Package: 0603; Case Code (Imperial): 0603; Case Code (Metric): 0603; China RoHS: Non-Compliant; Composition: Thick Film; Depth: 800µm; Height: 450µm; Lead Free: Lead Free; Lead Pitch: 300µm; Length: 1.6mm; Lifecycle Status: Production; Max Operating Temperature: 155°C; Military Standard: Not; Min Operating Temperature: -55°C; Mounting Technology: Surface Mount; Pins: 2; Number of Terminals: 2; Packaging: Tape & Reel; Power Rating: 100mW; REACH SVHC: Yes; Schedule B: 8533210045, 8533210045|8533210045|8533210045|8533210045|8533210045|8533210045|8533210045|8533210045|8533210045|8533210045|8533210045|8533210045|8533210045|8533210045|8533210045|8533210045|8533210045|8533210045|8533210045|8533210045|8533210045|8533210045|8533210045|85; Termination: SMD/SMT; Tolerance: 1%; Weight: 2.012816mg; Width: 800µm; Working Voltage: 75V; ComponentLink1URL: https://datasheet.octopart.com:443/RC0603FR-0710KL-Yageo-datasheet-175887523.pdf?src-supplier=IHS; ComponentLink1Description: https://datasheet.octopart.com:443/RC0603FR-0710KL-Yageo-datasheet-175887523.pdf?src-supplier=IHS; ComponentLink2URL: https://datasheet.octopart.com:443/RC0603FR-0710KL-Yageo-datasheet-103092701.pdf?src-supplier=Upverter; ComponentLink2Description: https://datasheet.octopart.com:443/RC0603FR-0710KL-Yageo-datasheet-103092701.pdf?src-supplier=Upverter; ComponentLink3URL: https://datasheet.octopart.com:443/RC0603FR-0710KL-Yageo-datasheet-98239111.pdf?src-supplier=Upverter; ComponentLink3Description: https://datasheet.octopart.com:443/RC0603FR-0710KL-Yageo-datasheet-98239111.pdf?src-supplier=Upverter; ComponentLink4URL: https://datasheet.octopart.com:443/RC0603FR-0710KL-Yageo-datasheet-141265859.pdf?src-supplier=Upverter; ComponentLink4Description: https://datasheet.octopart.com:443/RC0603FR-0710KL-Yageo-datasheet-141265859.pdf?src-supplier=Upverter; ComponentLink5URL: https://sigma.octopart.com:443/138820526/technical_drawing/Yageo-RC0603FR-0710KL.pdf?src-supplier=Upverter; ComponentLink5Description: https://sigma.octopart.com:443/138820526/technical_drawing/Yageo-RC0603FR-0710KL.pdf?src-supplier=Upverter; ComponentLink6URL: https://datasheet.octopart.com:443/RC0603FR-0710KL-Yageo-datasheet-8328172.pdf?src-supplier=Farnell; ComponentLink6Description: https://datasheet.octopart.com:443/RC0603FR-0710KL-Yageo-datasheet-8328172.pdf?src-supplier=Farnell; ComponentLink7URL: https://datasheet.octopart.com:443/RC0603FR-0710KL-Yageo-datasheet-13691069.pdf?src-supplier=Farnell; ComponentLink7Description: https://datasheet.octopart.com:443/RC0603FR-0710KL-Yageo-datasheet-13691069.pdf?src-supplier=Farnell; ComponentLink8URL: https://datasheet.octopart.com:443/RC0603FR-0710KL-Yageo-datasheet-62067350.pdf?src-supplier=element14+APAC; ComponentLink8Description: https://datasheet.octopart.com:443/RC0603FR-0710KL-Yageo-datasheet-62067350.pdf?src-supplier=element14+APAC; ComponentLink9URL: https://datasheet.octopart.com:443/RC0603FR-0710KL-Yageo-datasheet-17842380.pdf?src-supplier=element14+APAC; ComponentLink9Description: https://datasheet.octopart.com:443/RC0603FR-0710KL-Yageo-datasheet-17842380.pdf?src-supplier=element14+APAC; ComponentLink10URL: https://datasheet.octopart.com:443/RC0603FR-0710KL-Yageo-datasheet-15599030.pdf?src-supplier=Future+Electronics; ComponentLink10Description: https://datasheet.octopart.com:443/RC0603FR-0710KL-Yageo-datasheet-15599030.pdf?src-supplier=Future+Electronics; ComponentLink11URL: https://datasheet.octopart.com:443/RC0603FR-0710KL-Yageo-datasheet-164759695.pdf?src-supplier=Future+Electronics; ComponentLink11Description: https://datasheet.octopart.com:443/RC0603FR-0710KL-Yageo-datasheet-164759695.pdf?src-supplier=Future+Electronics; ComponentLink12URL: https://datasheet.octopart.com:443/RC0603FR-0710KL-Yageo-datasheet-127823281.pdf?src-supplier=Future+Electronics; ComponentLink12Description: https://datasheet.octopart.com:443/RC0603FR-0710KL-Yageo-datasheet-127823281.pdf?src-supplier=Future+Electronics; ComponentLink13URL: https://datasheet.octopart.com:443/RC0603FR-0710KL-Yageo-datasheet-137700087.pdf?src-supplier=Future+Electronics; ComponentLink13Description: https://datasheet.octopart.com:443/RC0603FR-0710KL-Yageo-datasheet-137700087.pdf?src-supplier=Future+Electronics; ComponentLink14URL: https://datasheet.octopart.com:443/RC0603FR-0710KL-Yageo-datasheet-27584510.pdf?src-supplier=Future+Electronics; ComponentLink14Description: https://datasheet.octopart.com:443/RC0603FR-0710KL-Yageo-datasheet-27584510.pdf?src-supplier=Future+Electronics; ComponentLink15URL: https://datasheet.octopart.com:443/RC0603FR-0710KL-Yageo-datasheet-8324193.pdf?src-supplier=Future+Electronics; ComponentLink15Description: https://datasheet.octopart.com:443/RC0603FR-0710KL-Yageo-datasheet-8324193.pdf?src-supplier=Future+Electronics; ComponentLink16URL: https://datasheet.octopart.com:443/RC0603FR-0710KL-Yageo-datasheet-12596169.pdf?src-supplier=Newark; ComponentLink16Description: https://datasheet.octopart.com:443/RC0603FR-0710KL-Yageo-datasheet-12596169.pdf?src-supplier=Newark; ComponentLink17URL: https://datasheet.octopart.com:443/RC0603FR-0710KL-Yageo-datasheet-503470.pdf?src-supplier=Newark; ComponentLink17Description: https://datasheet.octopart.com:443/RC0603FR-0710KL-Yageo-datasheet-503470.pdf?src-supplier=Newark; ComponentLink18URL: https://datasheet.octopart.com:443/RC0603FR-0710KL-Yageo-datasheet-34211833.pdf?src-supplier=Newark; ComponentLink18Description: https://datasheet.octopart.com:443/RC0603FR-0710KL-Yageo-datasheet-34211833.pdf?src-supplier=Newark; ComponentLink19URL: https://datasheet.octopart.com:443/RC0603FR-0710KL-Yageo-datasheet-79472498.pdf?src-supplier=Megastar; ComponentLink19Description: https://datasheet.octopart.com:443/RC0603FR-0710KL-Yageo-datasheet-79472498.pdf?src-supplier=Megastar; ComponentLink20URL: https://datasheet.octopart.com/RC0603FR-0710KL-Yageo-datasheet-73766026.pdf; ComponentLink20Description: https://datasheet.octopart.com/RC0603FR-0710KL-Yageo-datasheet-73766026.pdf; ComponentLink21URL: https://datasheet.octopart.com:443/RC0603FR-0710KL-Yageo-datasheet-118562.pdf?src-supplier=DigiKey; ComponentLink21Description: https://datasheet.octopart.com:443/RC0603FR-0710KL-Yageo-datasheet-118562.pdf?src-supplier=DigiKey; ComponentLink22URL: http://sigma.octopart.com:80/rohs_statement/Yageo-company-2.pdf?src-supplier=Compliance+Statements; ComponentLink22Description: http://sigma.octopart.com:80/rohs_statement/Yageo-company-2.pdf?src-supplier=Compliance+Statements; ComponentLink23URL: http://sigma.octopart.com:80/conflict_mineral_statement/Yageo-company-3.pdf?src-supplier=Compliance+Statements; ComponentLink23Description: http://sigma.octopart.com:80/conflict_mineral_statement/Yageo-company-3.pdf?src-supplier=Compliance+Statements; LCSC PN: C98220
R26 = ERJ-3EKF4750V: 475 Ohms ±1% 0.1W, 1/10W Chip Resistor 0603 (1608 Metric) Automotive AEC-Q200 Thick Film; Manufacturer: Panasonic; Max Power Dissipation: 100mW; Value: 475Ω; Temperature Coefficient: 100ppm/°C; Voltage Rating: 75V; Supplier: DigiKey; Manufacturer Part Number: ERJ-3EKF4750V; RoHS: Compliant; Category: Chip SMD Resistors; Stock: 64243; Pricing: 1=0.1, 10=0.034, 25=0.0256, 50=0.021, 100=0.0173, 250=0.01364, 500=0.01158, 1000=0.00995, 5000=0.00661, 10000=0.00546, 15000=0.00542, 25000=0.00537, 35000=0.00535, 50000=0.00532, 60000=0.00531, 120000=0.00509, 125000=0.00507 (USD); Case/Package: 0603; Case Code (Imperial): 0603; China RoHS: Non-Compliant; Composition: Thick Film; Contact Plating: Tin; Depth: 800µm; Features: Automotive AEC-Q200; Height: 450µm; Length: 1.6mm; Lifecycle Status: Production; Max Operating Temperature: 155°C; Military Standard: Not; Min Operating Temperature: -55°C; Mounting Technology: Surface Mount; Number of Terminals: 2; Number of Terminations: 2; Packaging: Cut Tape; Power Dissipation: 100mW; Power Rating: 100mW; Radiation Hardening: No; REACH SVHC: Yes; Schedule B: 8533210045, 8533210045|8533210045, 8533210045|8533210045|8533210045, 8533210045|8533210045|8533210045|8533210045; Termination: SMD/SMT; Tolerance: 1%; Width: 800µm; Working Voltage: 75V; ComponentLink1URL: https://datasheet.octopart.com:443/ERJ3EKF4750V-Panasonic-datasheet-182147282.pdf?src-supplier=IHS; ComponentLink1Description: https://datasheet.octopart.com:443/ERJ3EKF4750V-Panasonic-datasheet-182147282.pdf?src-supplier=IHS; ComponentLink2URL: https://datasheet.octopart.com:443/ERJ-3EKF4750V-Panasonic-datasheet-82288794.pdf?src-supplier=Panasonic+SCT; ComponentLink2Description: https://datasheet.octopart.com:443/ERJ-3EKF4750V-Panasonic-datasheet-82288794.pdf?src-supplier=Panasonic+SCT; ComponentLink3URL: https://datasheet.octopart.com:443/ERJ-3EKF4750V-Panasonic-datasheet-13266541.pdf?src-supplier=RS+(Formerly+Allied+Electronics); ComponentLink3Description: https://datasheet.octopart.com:443/ERJ-3EKF4750V-Panasonic-datasheet-13266541.pdf?src-supplier=RS+(Formerly+Allied+Electronics); ComponentLink4URL: https://datasheet.octopart.com:443/ERJ-3EKF4750V-Panasonic-datasheet-10025800.pdf?src-supplier=Future+Electronics; ComponentLink4Description: https://datasheet.octopart.com:443/ERJ-3EKF4750V-Panasonic-datasheet-10025800.pdf?src-supplier=Future+Electronics; ComponentLink5URL: https://datasheet.octopart.com:443/ERJ-3EKF4750V-Panasonic-datasheet-8853621.pdf?src-supplier=Future+Electronics; ComponentLink5Description: https://datasheet.octopart.com:443/ERJ-3EKF4750V-Panasonic-datasheet-8853621.pdf?src-supplier=Future+Electronics; ComponentLink6URL: https://datasheet.octopart.com:443/ERJ-3EKF4750V-Panasonic-datasheet-5313456.pdf?src-supplier=Newark; ComponentLink6Description: https://datasheet.octopart.com:443/ERJ-3EKF4750V-Panasonic-datasheet-5313456.pdf?src-supplier=Newark; ComponentLink7URL: https://datasheet.octopart.com:443/ERJ-3EKF4750V-Panasonic-datasheet-48891056.pdf?src-supplier=Newark; ComponentLink7Description: https://datasheet.octopart.com:443/ERJ-3EKF4750V-Panasonic-datasheet-48891056.pdf?src-supplier=Newark; ComponentLink8URL: https://datasheet.octopart.com:443/ERJ3EKF4750V-Panasonic-datasheet-168681906.pdf?src-supplier=Newark; ComponentLink8Description: https://datasheet.octopart.com:443/ERJ3EKF4750V-Panasonic-datasheet-168681906.pdf?src-supplier=Newark; ComponentLink9URL: https://datasheet.octopart.com:443/ERJ-3EKF4750V-Panasonic-datasheet-136608610.pdf?src-supplier=Farnell; ComponentLink9Description: https://datasheet.octopart.com:443/ERJ-3EKF4750V-Panasonic-datasheet-136608610.pdf?src-supplier=Farnell; ComponentLink10URL: https://datasheet.octopart.com:443/ERJ-3EKF4750V-Panasonic---ECG-datasheet-15994758.pdf?src-supplier=Farnell; ComponentLink10Description: https://datasheet.octopart.com:443/ERJ-3EKF4750V-Panasonic---ECG-datasheet-15994758.pdf?src-supplier=Farnell; ComponentLink11URL: https://datasheet.octopart.com:443/ERJ-3EKF4750V-Panasonic-datasheet-154766169.pdf?src-supplier=Master+Electronics; ComponentLink11Description: https://datasheet.octopart.com:443/ERJ-3EKF4750V-Panasonic-datasheet-154766169.pdf?src-supplier=Master+Electronics; ComponentLink12URL: https://datasheet.octopart.com:443/ERJ3EKF4750V-Panasonic-datasheet-138819429.pdf?src-supplier=Burklin+Elektronik; ComponentLink12Description: https://datasheet.octopart.com:443/ERJ3EKF4750V-Panasonic-datasheet-138819429.pdf?src-supplier=Burklin+Elektronik; ComponentLink13URL: https://datasheet.octopart.com/ERJ-3EKF4750V-Panasonic-datasheet-78375410.pdf; ComponentLink13Description: https://datasheet.octopart.com/ERJ-3EKF4750V-Panasonic-datasheet-78375410.pdf; ComponentLink14URL: https://datasheet.octopart.com:443/ERJ-3EKF4750V-Panasonic-datasheet-11542829.pdf?src-supplier=Arrow+Electronics; ComponentLink14Description: https://datasheet.octopart.com:443/ERJ-3EKF4750V-Panasonic-datasheet-11542829.pdf?src-supplier=Arrow+Electronics; ComponentLink15URL: https://datasheet.octopart.com:443/ERJ-3EKF4750V-Panasonic-datasheet-7538305.pdf?src-supplier=Jameco; ComponentLink15Description: https://datasheet.octopart.com:443/ERJ-3EKF4750V-Panasonic-datasheet-7538305.pdf?src-supplier=Jameco; ComponentLink16URL: https://datasheet.octopart.com:443/ERJ-3EKF4750V-Panasonic-datasheet-118621.pdf?src-supplier=DigiKey; ComponentLink16Description: https://datasheet.octopart.com:443/ERJ-3EKF4750V-Panasonic-datasheet-118621.pdf?src-supplier=DigiKey; ComponentLink17URL: https://datasheet.octopart.com:443/ERJ-3EKF4750V-Panasonic-datasheet-41391857.pdf?src-supplier=Electro+Sonic; ComponentLink17Description: https://datasheet.octopart.com:443/ERJ-3EKF4750V-Panasonic-datasheet-41391857.pdf?src-supplier=Electro+Sonic; LCSC PN: C278627